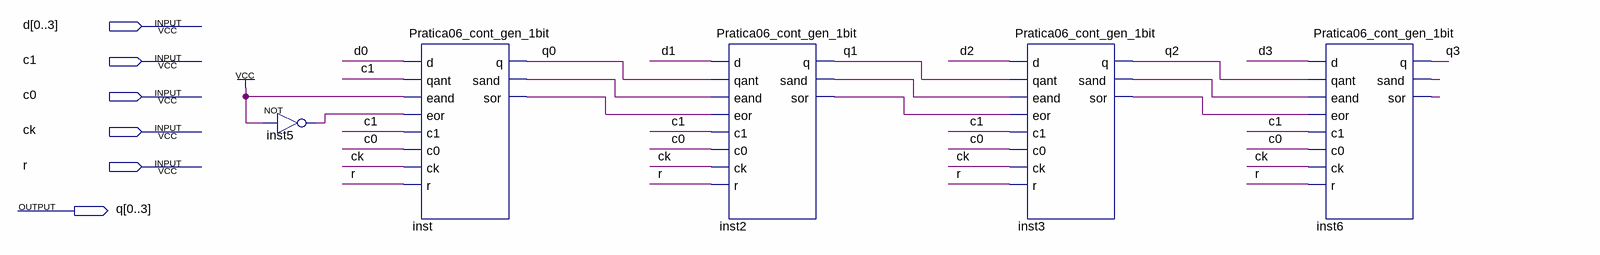
[diagram p0: schematic sheet]
// Quartus schematic Pratica06_cont_gen_4_bits.bdf as structural Verilog: 5 symbols, 6 pins
module Pratica06_cont_gen_4_bits (
  input  [0:3] d,
  input  c1,
  input  c0,
  input  ck,
  input  r,
  output [0:3] q
);

  wire inst2_sand, inst2_sor, inst3_sand, inst3_sor, inst5_out, inst6_sand, inst6_sor, inst_sand, inst_sor;

  not inst5 (inst5_out, 1'b1);
  Pratica06_cont_gen_1bit inst (
    .d(d[0]), .qant(c1), .eand(1'b1), .eor(inst5_out), .c1(c1), .c0(c0), .ck(ck), .r(r), .q(q[0]),
    .sand(inst_sand), .sor(inst_sor));
  Pratica06_cont_gen_1bit inst2 (
    .d(d[1]), .qant(q[0]), .eand(inst_sand), .eor(inst_sor), .c1(c1), .c0(c0), .ck(ck), .r(r), .q(q[1]),
    .sand(inst2_sand), .sor(inst2_sor));
  Pratica06_cont_gen_1bit inst3 (
    .d(d[2]), .qant(q[1]), .eand(inst2_sand), .eor(inst2_sor), .c1(c1), .c0(c0), .ck(ck), .r(r), .q(q[2]),
    .sand(inst3_sand), .sor(inst3_sor));
  Pratica06_cont_gen_1bit inst6 (
    .d(d[3]), .qant(q[2]), .eand(inst3_sand), .eor(inst3_sor), .c1(c1), .c0(c0), .ck(ck), .r(r), .q(q[3]),
    .sand(inst6_sand), .sor(inst6_sor));
endmodule
